# Altium schematic sheet Main.SchDoc
size A4; SheetNumber: 1; SheetTotal: 5
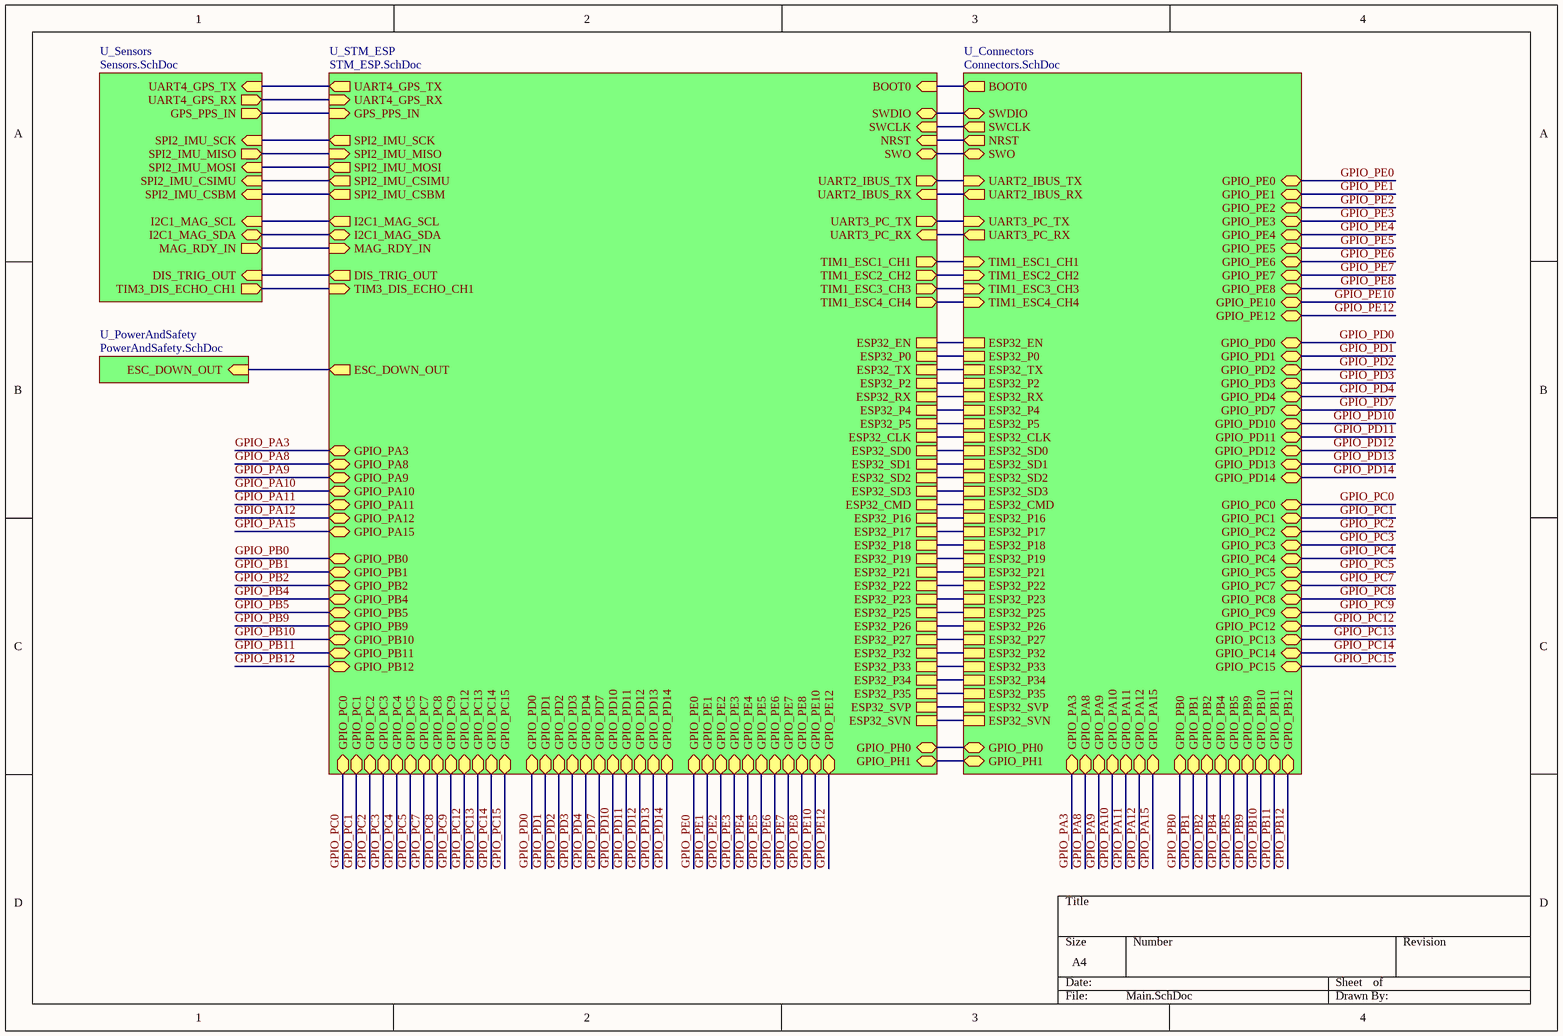
[diagram p0: Main.SchDoc]

## Sub-sheets
U_Connectors = Connectors.SchDoc: ESP32_EN, ESP32_SVP, ESP32_SVN, ESP32_P34, ESP32_P35, ESP32_P32, ESP32_P33, ESP32_P25, ESP32_P26, ESP32_P27, ESP32_SD2, ESP32_SD3, ESP32_CMD, ESP32_P23, ESP32_P22, ESP32_TX, ESP32_RX, ESP32_P21, ESP32_P19, ESP32_P18, ESP32_P5, ESP32_P17, ESP32_P16, ESP32_P4, ESP32_P0, ESP32_SD1, ESP32_SD0, ESP32_CLK, ESP32_P2, GPIO_PA3 (bidir), GPIO_PA8 (bidir), GPIO_PA11 (bidir), GPIO_PA12 (bidir), GPIO_PA15 (bidir), GPIO_PB0 (bidir), GPIO_PB1 (bidir), GPIO_PB4 (bidir), GPIO_PB5 (bidir), GPIO_PB10 (bidir), GPIO_PC2 (bidir), GPIO_PC3 (bidir), GPIO_PH0 (bidir), GPIO_PH1 (bidir), GPIO_PB9 (bidir), BOOT0 (out), NRST (out), SWO (bidir), TIM1_ESC1_CH1 (in), TIM1_ESC2_CH2 (in), TIM1_ESC3_CH3 (in), TIM1_ESC4_CH4 (in), UART2_IBUS_TX (in), UART2_IBUS_RX (out), GPIO_PA9 (bidir), GPIO_PC15 (bidir), GPIO_PB2 (bidir), GPIO_PB11 (bidir), GPIO_PB12 (bidir), GPIO_PD0 (bidir), GPIO_PD1 (bidir), GPIO_PD2 (bidir), GPIO_PD3 (bidir), GPIO_PD4 (bidir), GPIO_PD7 (bidir), GPIO_PD10 (bidir), GPIO_PD11 (bidir), GPIO_PD12 (bidir), GPIO_PD13 (bidir), GPIO_PD14 (bidir), GPIO_PE0 (bidir), GPIO_PE5 (bidir), GPIO_PE6 (bidir), GPIO_PE7 (bidir), GPIO_PE8 (bidir), GPIO_PE10 (bidir), GPIO_PE12 (bidir), GPIO_PC0 (bidir), GPIO_PC1 (bidir), GPIO_PC4 (bidir), GPIO_PC5 (bidir), GPIO_PC7 (bidir), GPIO_PC8 (bidir), GPIO_PC9 (bidir), GPIO_PC12 (bidir), GPIO_PC13 (bidir), GPIO_PC14 (bidir), GPIO_PE1 (bidir), GPIO_PE2 (bidir), GPIO_PE3 (bidir), GPIO_PE4 (bidir), SWDIO (bidir), SWCLK (out), UART3_PC_TX (in), UART3_PC_RX (out), GPIO_PA10 (bidir)
U_PowerAndSafety = PowerAndSafety.SchDoc: ESC_DOWN_OUT (in)
U_Sensors = Sensors.SchDoc: UART4_GPS_TX (in), UART4_GPS_RX (out), GPS_PPS_IN (out), SPI2_IMU_CSIMU (in), SPI2_IMU_SCK (in), SPI2_IMU_MISO (out), SPI2_IMU_MOSI (in), SPI2_IMU_CSBM (in), I2C1_MAG_SCL (in), I2C1_MAG_SDA (bidir), MAG_RDY_IN (out), DIS_TRIG_OUT (in), TIM3_DIS_ECHO_CH1 (out)
U_STM_ESP = STM_ESP.SchDoc: GPIO_PA3 (bidir), GPIO_PA8 (bidir), GPIO_PB9 (bidir), GPIO_PB10 (bidir), BOOT0 (in), NRST (in), GPIO_PA11 (bidir), GPIO_PA12 (bidir), GPIO_PA15 (bidir), GPIO_PB0 (bidir), GPIO_PB1 (bidir), GPIO_PB4 (bidir), GPIO_PB5 (bidir), GPIO_PC2 (bidir), GPIO_PC3 (bidir), GPIO_PH0 (bidir), GPIO_PH1 (bidir), ESP32_EN, ESP32_SVP, ESP32_SVN, ESP32_P34, ESP32_P35, ESP32_P32, ESP32_P33, ESP32_P25, ESP32_P26, ESP32_P27, ESP32_SD2, ESP32_SD3, ESP32_CMD, ESP32_P23, ESP32_P22, ESP32_TX, ESP32_RX, ESP32_P21, ESP32_P19, ESP32_P18, ESP32_P5, ESP32_P17, ESP32_P16, ESP32_P4, ESP32_P0, ESP32_SD1, ESP32_SD0, ESP32_CLK, ESP32_P2, SWO (bidir), UART4_GPS_TX (out), UART4_GPS_RX (in), I2C1_MAG_SCL (out), I2C1_MAG_SDA (bidir), SPI2_IMU_SCK (out), SPI2_IMU_MISO (in), SPI2_IMU_MOSI (out), GPS_PPS_IN (in), SPI2_IMU_CSIMU (out), SPI2_IMU_CSBM (out), MAG_RDY_IN (in), TIM1_ESC1_CH1 (out), TIM1_ESC2_CH2 (out), TIM1_ESC3_CH3 (out), TIM1_ESC4_CH4 (out), ESC_DOWN_OUT (out), SWDIO (bidir), SWCLK (in), UART3_PC_TX (out), UART3_PC_RX (in), DIS_TRIG_OUT (out), TIM3_DIS_ECHO_CH1 (in), GPIO_PA9 (bidir), GPIO_PA10 (bidir), GPIO_PC0 (bidir), GPIO_PC1 (bidir), GPIO_PC4 (bidir), GPIO_PC5 (bidir), GPIO_PC7 (bidir), GPIO_PC8 (bidir), GPIO_PC9 (bidir), GPIO_PC12 (bidir), GPIO_PC13 (bidir), GPIO_PC14 (bidir), GPIO_PC15 (bidir), GPIO_PB2 (bidir), GPIO_PB11 (bidir), GPIO_PB12 (bidir), GPIO_PD0 (bidir), GPIO_PD1 (bidir), GPIO_PD2 (bidir), GPIO_PD3 (bidir), GPIO_PD4 (bidir), GPIO_PD7 (bidir), GPIO_PD10 (bidir), GPIO_PD11 (bidir), GPIO_PD12 (bidir), GPIO_PD13 (bidir), GPIO_PD14 (bidir), GPIO_PE0 (bidir), GPIO_PE1 (bidir), GPIO_PE2 (bidir), GPIO_PE3 (bidir), GPIO_PE4 (bidir), GPIO_PE5 (bidir), GPIO_PE6 (bidir), GPIO_PE7 (bidir), GPIO_PE8 (bidir), GPIO_PE10 (bidir), GPIO_PE12 (bidir), UART2_IBUS_TX (out), UART2_IBUS_RX (in)

## Nets
GPIO_PA3: sheet U_STM_ESP/GPIO_PA3, sheet U_Connectors/GPIO_PA3
GPIO_PA8: sheet U_STM_ESP/GPIO_PA8, sheet U_Connectors/GPIO_PA8
GPIO_PA9: sheet U_STM_ESP/GPIO_PA9, sheet U_Connectors/GPIO_PA9
GPIO_PA10: sheet U_STM_ESP/GPIO_PA10, sheet U_Connectors/GPIO_PA10
GPIO_PA11: sheet U_STM_ESP/GPIO_PA11, sheet U_Connectors/GPIO_PA11
GPIO_PA12: sheet U_STM_ESP/GPIO_PA12, sheet U_Connectors/GPIO_PA12
GPIO_PA15: sheet U_STM_ESP/GPIO_PA15, sheet U_Connectors/GPIO_PA15
GPIO_PB0: sheet U_STM_ESP/GPIO_PB0, sheet U_Connectors/GPIO_PB0
GPIO_PB1: sheet U_STM_ESP/GPIO_PB1, sheet U_Connectors/GPIO_PB1
GPIO_PB2: sheet U_STM_ESP/GPIO_PB2, sheet U_Connectors/GPIO_PB2
GPIO_PB4: sheet U_STM_ESP/GPIO_PB4, sheet U_Connectors/GPIO_PB4
GPIO_PB5: sheet U_STM_ESP/GPIO_PB5, sheet U_Connectors/GPIO_PB5
GPIO_PB9: sheet U_STM_ESP/GPIO_PB9, sheet U_Connectors/GPIO_PB9
GPIO_PB10: sheet U_STM_ESP/GPIO_PB10, sheet U_Connectors/GPIO_PB10
GPIO_PB11: sheet U_STM_ESP/GPIO_PB11, sheet U_Connectors/GPIO_PB11
GPIO_PB12: sheet U_STM_ESP/GPIO_PB12, sheet U_Connectors/GPIO_PB12
GPIO_PC0: sheet U_STM_ESP/GPIO_PC0, sheet U_Connectors/GPIO_PC0
GPIO_PC1: sheet U_STM_ESP/GPIO_PC1, sheet U_Connectors/GPIO_PC1
GPIO_PC2: sheet U_STM_ESP/GPIO_PC2, sheet U_Connectors/GPIO_PC2
GPIO_PC3: sheet U_STM_ESP/GPIO_PC3, sheet U_Connectors/GPIO_PC3
GPIO_PC4: sheet U_STM_ESP/GPIO_PC4, sheet U_Connectors/GPIO_PC4
GPIO_PC5: sheet U_STM_ESP/GPIO_PC5, sheet U_Connectors/GPIO_PC5
GPIO_PC7: sheet U_STM_ESP/GPIO_PC7, sheet U_Connectors/GPIO_PC7
GPIO_PC8: sheet U_STM_ESP/GPIO_PC8, sheet U_Connectors/GPIO_PC8
GPIO_PC9: sheet U_STM_ESP/GPIO_PC9, sheet U_Connectors/GPIO_PC9
GPIO_PC12: sheet U_STM_ESP/GPIO_PC12, sheet U_Connectors/GPIO_PC12
GPIO_PC13: sheet U_STM_ESP/GPIO_PC13, sheet U_Connectors/GPIO_PC13
GPIO_PC14: sheet U_STM_ESP/GPIO_PC14, sheet U_Connectors/GPIO_PC14
GPIO_PC15: sheet U_STM_ESP/GPIO_PC15, sheet U_Connectors/GPIO_PC15
GPIO_PD0: sheet U_STM_ESP/GPIO_PD0, sheet U_Connectors/GPIO_PD0
GPIO_PD1: sheet U_STM_ESP/GPIO_PD1, sheet U_Connectors/GPIO_PD1
GPIO_PD2: sheet U_STM_ESP/GPIO_PD2, sheet U_Connectors/GPIO_PD2
GPIO_PD3: sheet U_STM_ESP/GPIO_PD3, sheet U_Connectors/GPIO_PD3
GPIO_PD4: sheet U_STM_ESP/GPIO_PD4, sheet U_Connectors/GPIO_PD4
GPIO_PD7: sheet U_STM_ESP/GPIO_PD7, sheet U_Connectors/GPIO_PD7
GPIO_PD10: sheet U_STM_ESP/GPIO_PD10, sheet U_Connectors/GPIO_PD10
GPIO_PD11: sheet U_STM_ESP/GPIO_PD11, sheet U_Connectors/GPIO_PD11
GPIO_PD12: sheet U_STM_ESP/GPIO_PD12, sheet U_Connectors/GPIO_PD12
GPIO_PD13: sheet U_STM_ESP/GPIO_PD13, sheet U_Connectors/GPIO_PD13
GPIO_PD14: sheet U_STM_ESP/GPIO_PD14, sheet U_Connectors/GPIO_PD14
GPIO_PE0: sheet U_STM_ESP/GPIO_PE0, sheet U_Connectors/GPIO_PE0
GPIO_PE1: sheet U_STM_ESP/GPIO_PE1, sheet U_Connectors/GPIO_PE1
GPIO_PE2: sheet U_STM_ESP/GPIO_PE2, sheet U_Connectors/GPIO_PE2
GPIO_PE3: sheet U_STM_ESP/GPIO_PE3, sheet U_Connectors/GPIO_PE3
GPIO_PE4: sheet U_STM_ESP/GPIO_PE4, sheet U_Connectors/GPIO_PE4
GPIO_PE5: sheet U_STM_ESP/GPIO_PE5, sheet U_Connectors/GPIO_PE5
GPIO_PE6: sheet U_STM_ESP/GPIO_PE6, sheet U_Connectors/GPIO_PE6
GPIO_PE7: sheet U_STM_ESP/GPIO_PE7, sheet U_Connectors/GPIO_PE7
GPIO_PE8: sheet U_STM_ESP/GPIO_PE8, sheet U_Connectors/GPIO_PE8
GPIO_PE10: sheet U_STM_ESP/GPIO_PE10, sheet U_Connectors/GPIO_PE10
GPIO_PE12: sheet U_STM_ESP/GPIO_PE12, sheet U_Connectors/GPIO_PE12
(unnamed): sheet U_STM_ESP/BOOT0, sheet U_Connectors/BOOT0
(unnamed): sheet U_STM_ESP/NRST, sheet U_Connectors/NRST
(unnamed): sheet U_STM_ESP/GPIO_PH0, sheet U_Connectors/GPIO_PH0
(unnamed): sheet U_STM_ESP/GPIO_PH1, sheet U_Connectors/GPIO_PH1
(unnamed): sheet U_STM_ESP/ESP32_EN, sheet U_Connectors/ESP32_EN
(unnamed): sheet U_STM_ESP/ESP32_SVP, sheet U_Connectors/ESP32_SVP
(unnamed): sheet U_STM_ESP/ESP32_SVN, sheet U_Connectors/ESP32_SVN
(unnamed): sheet U_STM_ESP/ESP32_P34, sheet U_Connectors/ESP32_P34
(unnamed): sheet U_STM_ESP/ESP32_P35, sheet U_Connectors/ESP32_P35
(unnamed): sheet U_STM_ESP/ESP32_P32, sheet U_Connectors/ESP32_P32
(unnamed): sheet U_STM_ESP/ESP32_P33, sheet U_Connectors/ESP32_P33
(unnamed): sheet U_STM_ESP/ESP32_P25, sheet U_Connectors/ESP32_P25
(unnamed): sheet U_STM_ESP/ESP32_P26, sheet U_Connectors/ESP32_P26
(unnamed): sheet U_STM_ESP/ESP32_P27, sheet U_Connectors/ESP32_P27
(unnamed): sheet U_STM_ESP/ESP32_SD2, sheet U_Connectors/ESP32_SD2
(unnamed): sheet U_STM_ESP/ESP32_SD3, sheet U_Connectors/ESP32_SD3
(unnamed): sheet U_STM_ESP/ESP32_CMD, sheet U_Connectors/ESP32_CMD
(unnamed): sheet U_STM_ESP/ESP32_P23, sheet U_Connectors/ESP32_P23
(unnamed): sheet U_STM_ESP/ESP32_P22, sheet U_Connectors/ESP32_P22
(unnamed): sheet U_STM_ESP/ESP32_TX, sheet U_Connectors/ESP32_TX
(unnamed): sheet U_STM_ESP/ESP32_RX, sheet U_Connectors/ESP32_RX
(unnamed): sheet U_STM_ESP/ESP32_P21, sheet U_Connectors/ESP32_P21
(unnamed): sheet U_STM_ESP/ESP32_P19, sheet U_Connectors/ESP32_P19
(unnamed): sheet U_STM_ESP/ESP32_P18, sheet U_Connectors/ESP32_P18
(unnamed): sheet U_STM_ESP/ESP32_P5, sheet U_Connectors/ESP32_P5
(unnamed): sheet U_STM_ESP/ESP32_P17, sheet U_Connectors/ESP32_P17
(unnamed): sheet U_STM_ESP/ESP32_P16, sheet U_Connectors/ESP32_P16
(unnamed): sheet U_STM_ESP/ESP32_P4, sheet U_Connectors/ESP32_P4
(unnamed): sheet U_STM_ESP/ESP32_P0, sheet U_Connectors/ESP32_P0
(unnamed): sheet U_STM_ESP/ESP32_SD1, sheet U_Connectors/ESP32_SD1
(unnamed): sheet U_STM_ESP/ESP32_SD0, sheet U_Connectors/ESP32_SD0
(unnamed): sheet U_STM_ESP/ESP32_CLK, sheet U_Connectors/ESP32_CLK
(unnamed): sheet U_STM_ESP/ESP32_P2, sheet U_Connectors/ESP32_P2
(unnamed): sheet U_STM_ESP/SWO, sheet U_Connectors/SWO
(unnamed): sheet U_STM_ESP/UART4_GPS_TX, sheet U_Sensors/UART4_GPS_TX
(unnamed): sheet U_STM_ESP/UART4_GPS_RX, sheet U_Sensors/UART4_GPS_RX
(unnamed): sheet U_STM_ESP/I2C1_MAG_SCL, sheet U_Sensors/I2C1_MAG_SCL
(unnamed): sheet U_STM_ESP/I2C1_MAG_SDA, sheet U_Sensors/I2C1_MAG_SDA
(unnamed): sheet U_STM_ESP/SPI2_IMU_SCK, sheet U_Sensors/SPI2_IMU_SCK
(unnamed): sheet U_STM_ESP/SPI2_IMU_MISO, sheet U_Sensors/SPI2_IMU_MISO
(unnamed): sheet U_STM_ESP/SPI2_IMU_MOSI, sheet U_Sensors/SPI2_IMU_MOSI
(unnamed): sheet U_STM_ESP/GPS_PPS_IN, sheet U_Sensors/GPS_PPS_IN
(unnamed): sheet U_STM_ESP/SPI2_IMU_CSIMU, sheet U_Sensors/SPI2_IMU_CSIMU
(unnamed): sheet U_STM_ESP/SPI2_IMU_CSBM, sheet U_Sensors/SPI2_IMU_CSBM
(unnamed): sheet U_STM_ESP/MAG_RDY_IN, sheet U_Sensors/MAG_RDY_IN
(unnamed): sheet U_STM_ESP/TIM1_ESC1_CH1, sheet U_Connectors/TIM1_ESC1_CH1
(unnamed): sheet U_STM_ESP/TIM1_ESC2_CH2, sheet U_Connectors/TIM1_ESC2_CH2
(unnamed): sheet U_STM_ESP/TIM1_ESC3_CH3, sheet U_Connectors/TIM1_ESC3_CH3
(unnamed): sheet U_STM_ESP/TIM1_ESC4_CH4, sheet U_Connectors/TIM1_ESC4_CH4
(unnamed): sheet U_STM_ESP/ESC_DOWN_OUT, sheet U_PowerAndSafety/ESC_DOWN_OUT
(unnamed): sheet U_STM_ESP/SWDIO, sheet U_Connectors/SWDIO
(unnamed): sheet U_STM_ESP/SWCLK, sheet U_Connectors/SWCLK
(unnamed): sheet U_STM_ESP/UART3_PC_TX, sheet U_Connectors/UART3_PC_TX
(unnamed): sheet U_STM_ESP/UART3_PC_RX, sheet U_Connectors/UART3_PC_RX
(unnamed): sheet U_STM_ESP/DIS_TRIG_OUT, sheet U_Sensors/DIS_TRIG_OUT
(unnamed): sheet U_STM_ESP/TIM3_DIS_ECHO_CH1, sheet U_Sensors/TIM3_DIS_ECHO_CH1
(unnamed): sheet U_STM_ESP/UART2_IBUS_TX, sheet U_Connectors/UART2_IBUS_TX
(unnamed): sheet U_STM_ESP/UART2_IBUS_RX, sheet U_Connectors/UART2_IBUS_RX